# EAGLE design homecomputer-6502 (EAGLE 6.5.0)

## Sheet 1 of 2
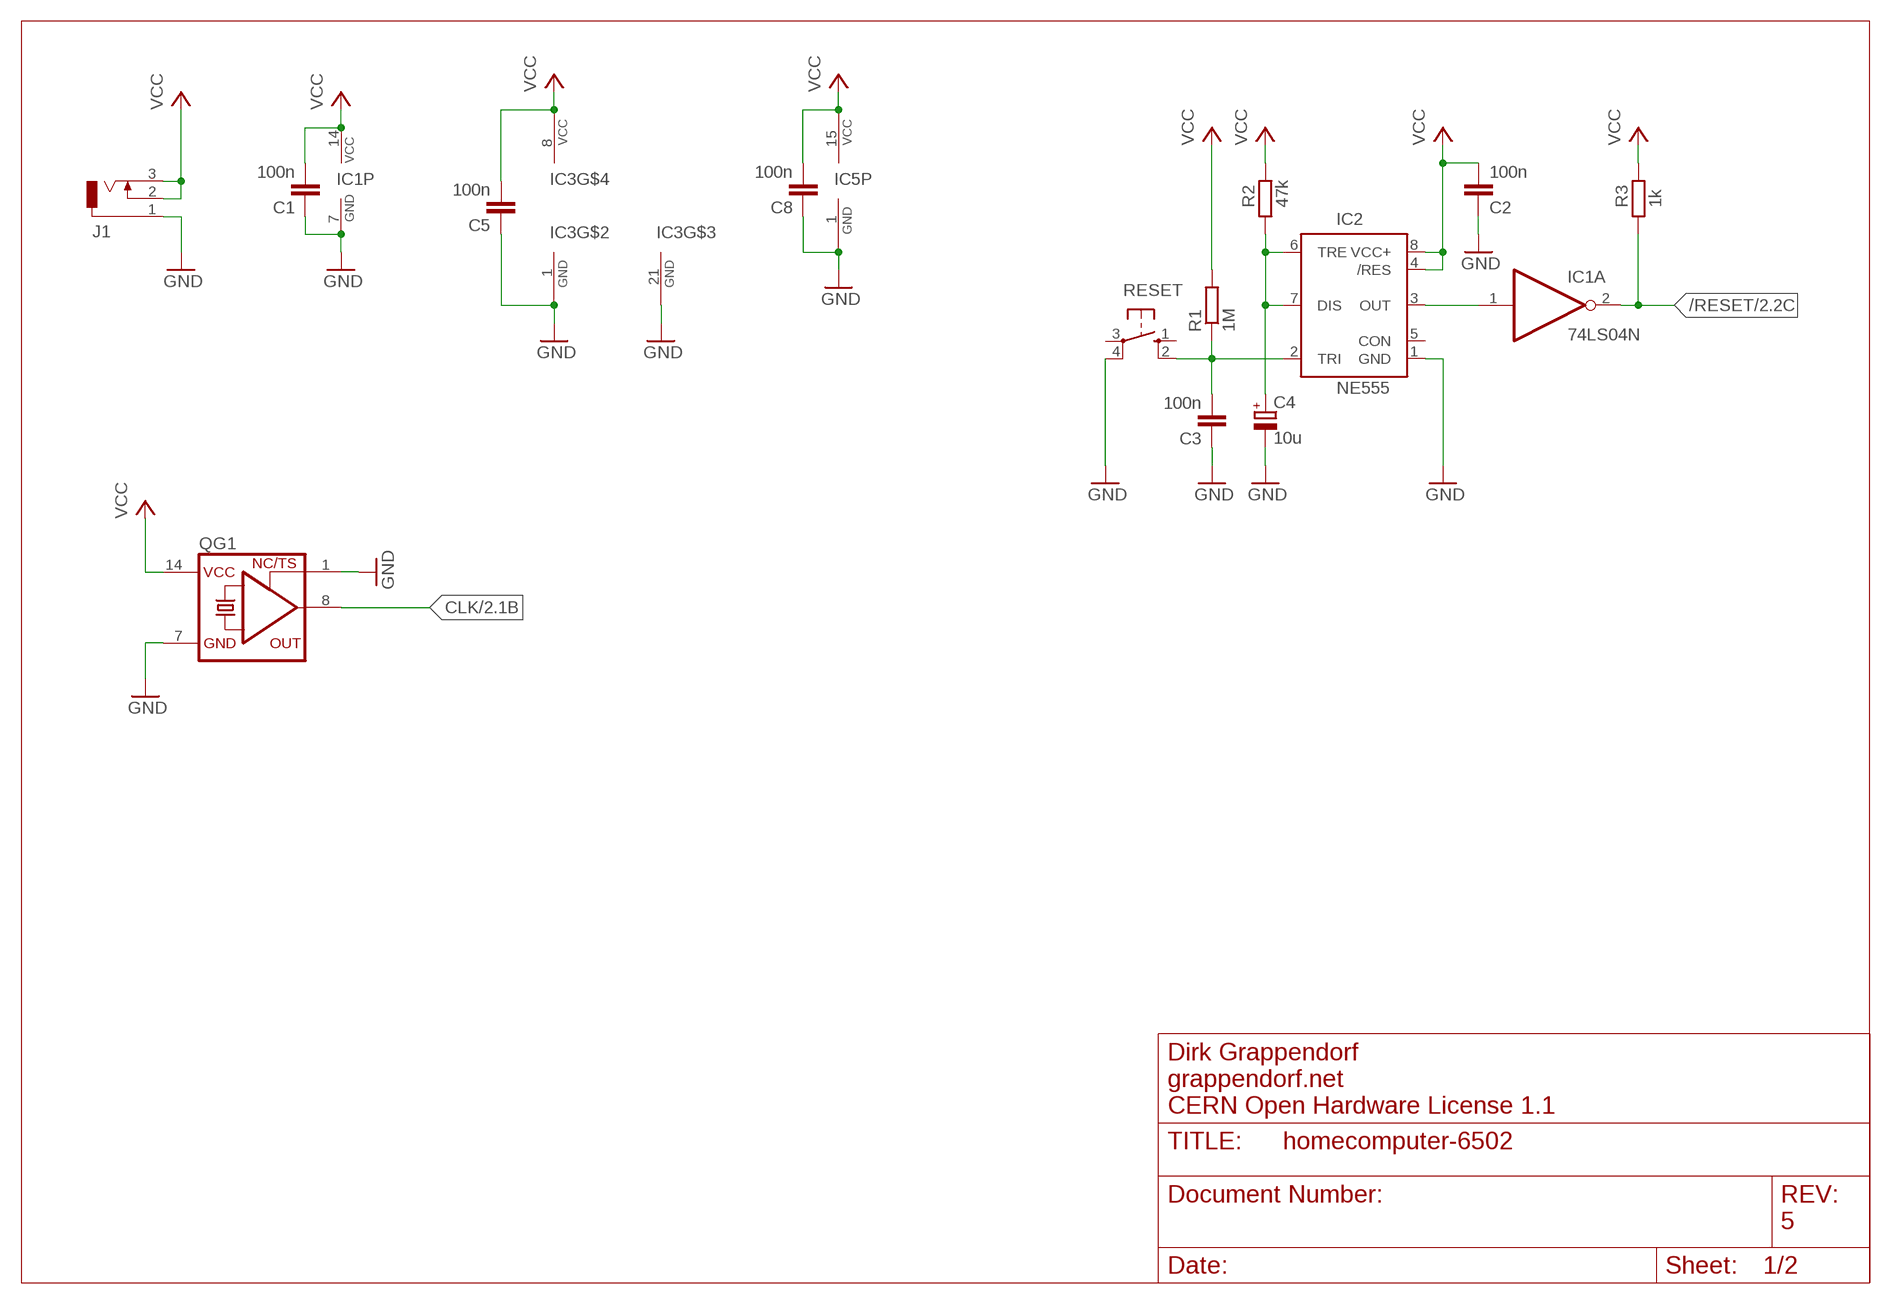
[diagram p0: schematic, sheet 1]

### Parts
C1  100n  C-EU025-024X044  [C025-024X044]
C2  100n  C-EU025-024X044  [C025-024X044]
C3  100n  C-EU025-024X044  [C025-024X044]
C4  10u  CPOL-EUE2,5-6E  [E2,5-6E]
C5  100n  C-EU025-024X044  [C025-024X044]
C8  100n  C-EU025-024X044  [C025-024X044]
IC1  74LS04N  [DIL14]
IC2  NE555  [DIL-08]
IC3  6502  [DIP40]
IC5  6551  [DIP28]
J1  DCJ0303  [DCJ0303]
QG1  XO-14  [DIL14S]
R1  1M  R-EU_0204/5  [0204/5]
R2  47k  R-EU_0204/5  [0204/5]
R3  1k  R-EU_0204/5  [0204/5]
RESET  10-XX  [B3F-10XX]

### Nets
/RESET: IC1.2(A:O) R3.1 ; also sheet 2
CLK: QG1.8(OUT) ; also sheet 2
GND: C1.1 C2.1 C3.1 C4.- C5.1 C8.1 IC1.7(P:GND) IC2.1(GND) IC3.1(GND) IC3.21(GND) IC5.1(GND) J1.1 QG1.1(TS) QG1.7(GND) RESET.4(P1) ; also sheet 2
N$4: C4.+ IC2.6(TRE) IC2.7(DIS) R2.1
N$5: IC1.1(A:I) IC2.3(OUT)
N$6: C3.2 IC2.2(TRI) R1.1 RESET.2(S1)
VCC: C1.2 C2.2 C5.2 C8.2 IC1.14(P:VCC) IC2.4(/RES) IC2.8(VCC+) IC3.8(VCC) IC5.15(VCC) J1.2 J1.3 QG1.14(VCC) R1.2 R2.2 R3.2 ; also sheet 2
Unconnected: IC1.5(C:I) IC1.6(C:O) IC1.8(D:O) IC1.9(D:I) IC1.10(E:O) IC1.11(E:I) IC1.12(F:O) IC1.13(F:I) IC2.5(CON) RESET.1(S) RESET.3(P)

### Notes on the sheet
- Dirk Grappendorf
- grappendorf.net
- CERN Open Hardware License 1.1
- 5

## Sheet 2 of 2
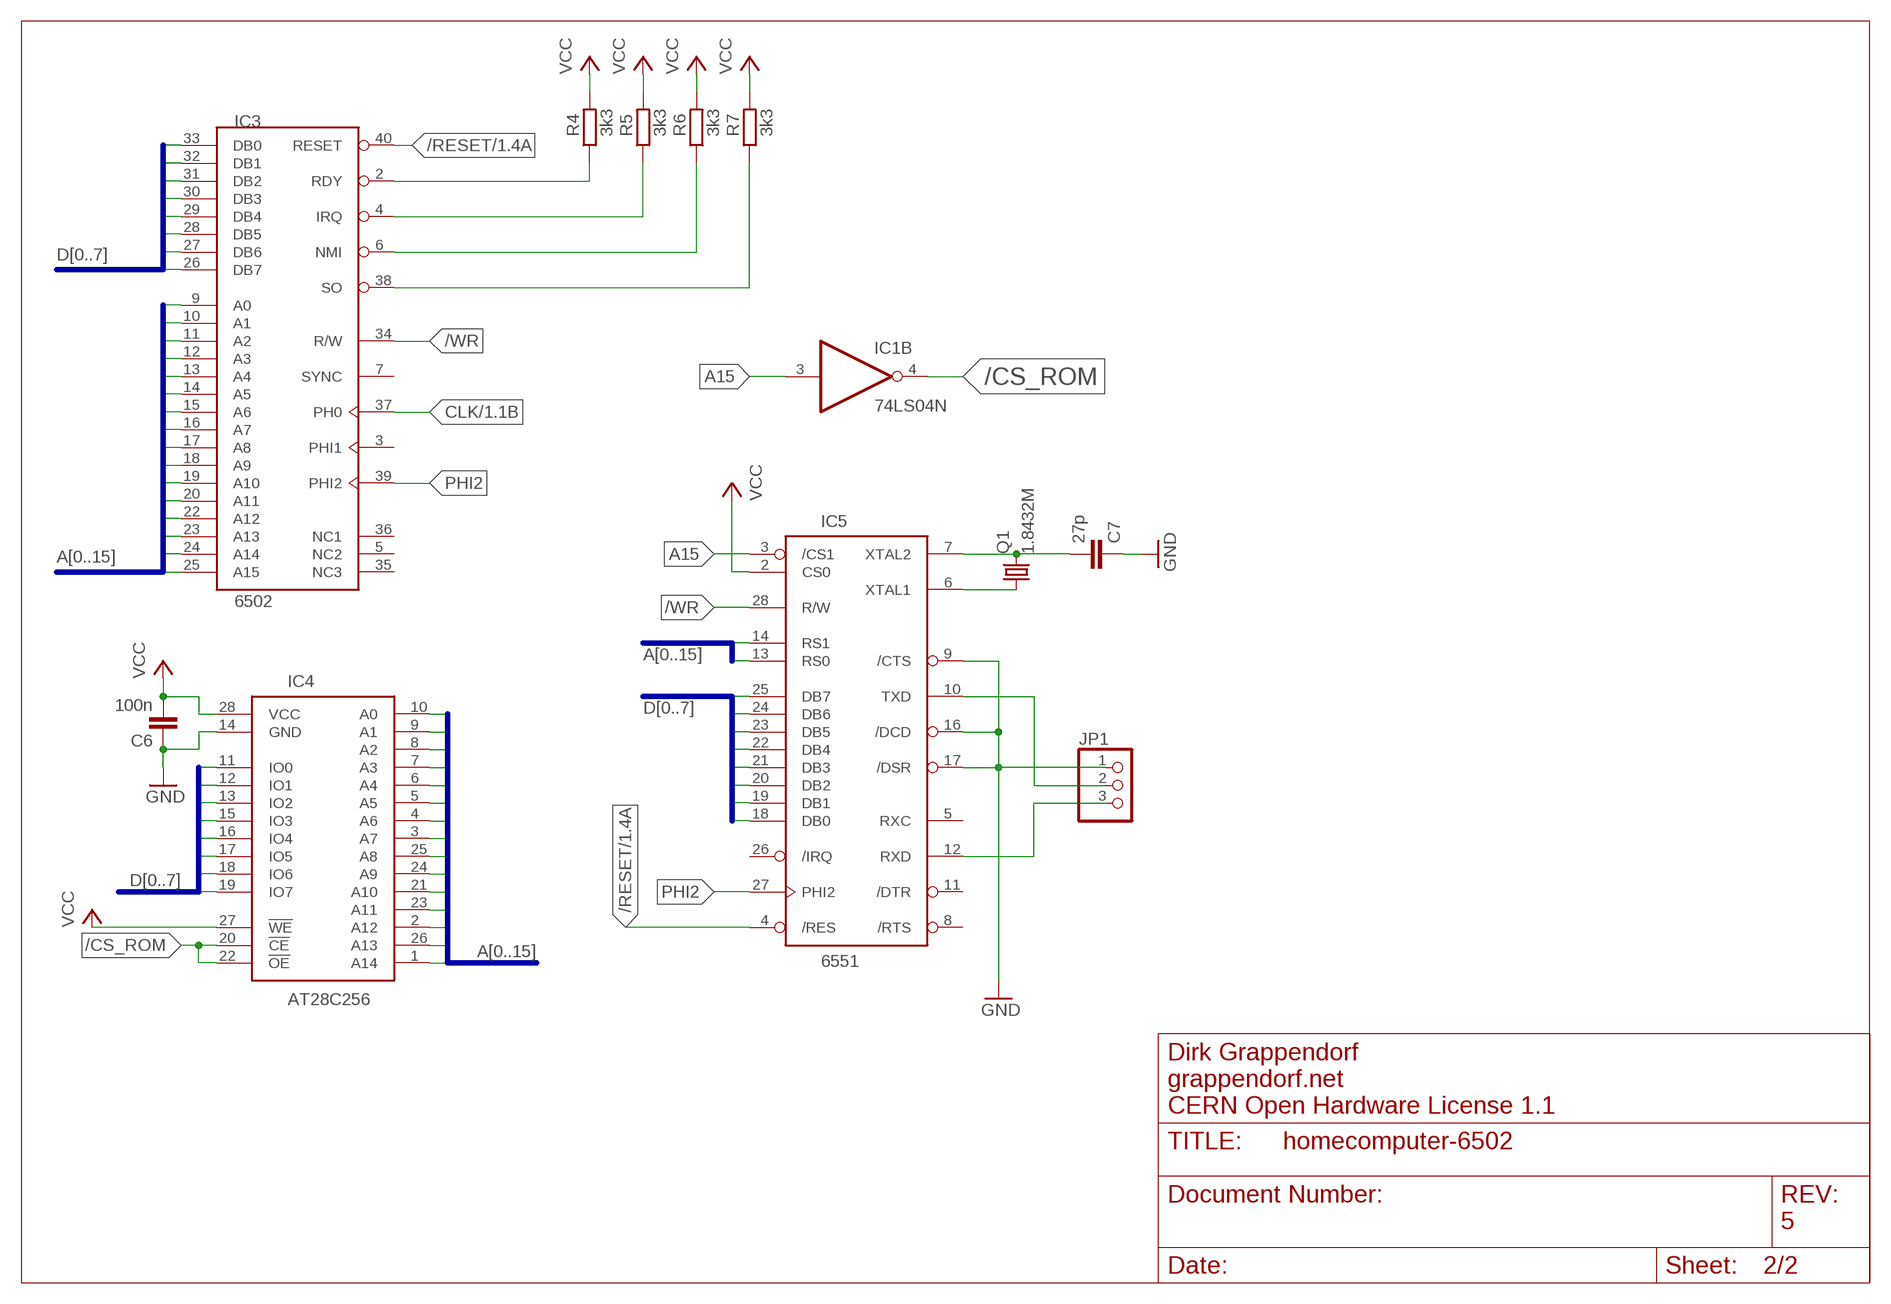
[diagram p1: schematic, sheet 2]

### Parts
C6  100n  C-EU025-024X044  [C025-024X044]
C7  27p  C-EU025-024X044  [C025-024X044]
IC4  AT28C256  [DIL28-6]
JP1  PINHD-1X3_2.54  [1X03]
Q1  1.8432M  CRYSTALHC49U-V  [HC49U-V]
R4  3k3  R-EU_0204/5  [0204/5]
R5  3k3  R-EU_0204/5  [0204/5]
R6  3k3  R-EU_0204/5  [0204/5]
R7  3k3  R-EU_0204/5  [0204/5]

### Nets
/CS_ROM: IC1.4(B:O) IC4.20(!CE) IC4.22(!OE)
/RESET: IC3.40(RESET) IC5.4(/RES) ; also sheet 1
/WR: IC3.34(R/W) IC5.28(R/W)
A0: IC3.9(A0) IC4.10(A0) IC5.13(RS0)
A1: IC3.10(A1) IC4.9(A1) IC5.14(RS1)
A2: IC3.11(A2) IC4.8(A2)
A3: IC3.12(A3) IC4.7(A3)
A4: IC3.13(A4) IC4.6(A4)
A5: IC3.14(A5) IC4.5(A5)
A6: IC3.15(A6) IC4.4(A6)
A7: IC3.16(A7) IC4.3(A7)
A8: IC3.17(A8) IC4.25(A8)
A9: IC3.18(A9) IC4.24(A9)
A10: IC3.19(A10) IC4.21(A10)
A11: IC3.20(A11) IC4.23(A11)
A12: IC3.22(A12) IC4.2(A12)
A13: IC3.23(A13) IC4.26(A13)
A14: IC3.24(A14) IC4.1(A14)
A15: IC1.3(B:I) IC3.25(A15) IC5.3(/CS1)
CLK: IC3.37(PH0) ; also sheet 1
D0: IC3.33(DB0) IC4.11(IO0) IC5.18(DB0)
D1: IC3.32(DB1) IC4.12(IO1) IC5.19(DB1)
D2: IC3.31(DB2) IC4.13(IO2) IC5.20(DB2)
D3: IC3.30(DB3) IC4.15(IO3) IC5.21(DB3)
D4: IC3.29(DB4) IC4.16(IO4) IC5.22(DB4)
D5: IC3.28(DB5) IC4.17(IO5) IC5.23(DB5)
D6: IC3.27(DB6) IC4.18(IO6) IC5.24(DB6)
D7: IC3.26(DB7) IC4.19(IO7) IC5.25(DB7)
GND: C6.1 C7.1 IC4.14(GND) IC5.9(/CTS) IC5.16(/DCD) IC5.17(/DSR) JP1.1 ; also sheet 1
N$1: C7.2 IC5.7(XTAL2) Q1.2
N$2: IC5.6(XTAL1) Q1.1
N$3: IC3.2(RDY) R4.1
N$8: IC5.10(TXD) JP1.2
N$9: IC3.4(IRQ) R5.1
N$10: IC3.6(NMI) R6.1
N$11: IC3.38(SO) R7.1
N$12: IC5.12(RXD) JP1.3
PHI2: IC3.39(PHI2) IC5.27(PHI2)
VCC: C6.2 IC4.27(!WE) IC4.28(VCC) IC5.2(CS0) R4.2 R5.2 R6.2 R7.2 ; also sheet 1
Unconnected: IC3.3(PHI1) IC3.5(NC2) IC3.7(SYNC) IC3.35(NC3) IC3.36(NC1) IC5.5(RXC) IC5.8(/RTS) IC5.11(/DTR) IC5.26(/IRQ)

### Buses
A[0..15]
D[0..7]

### Notes on the sheet
- Dirk Grappendorf
- grappendorf.net
- CERN Open Hardware License 1.1
- 5

## Library data of the parts
C1-C3 C5-C8 = rcl:C-EU: CAPACITOR, European symbol
C4 = rcl:CPOL-EU: POLARIZED CAPACITOR, European symbol
IC1 = 74xx-eu:74*04: Hex INVERTER
IC2 = st-microelectronics:NE555: General purpose bipolar Timer; MF: Arrow Electronics; MPN: NE555N; OC_FARNELL: 1467742; OC_NEWARK: 89K1486
IC3 = 6502:6502: 6502 processor
IC4 = atmel-28c:AT28C256: EEPROM 32Kx8 256k bit The AT28C256 is a high-performance Electrically Erasable and Programmable Read Only Memory. Its 256K of memory is organized as 32,768 words by 8 bits.
IC5 = 6502:6551: ACIA. Capable of RS-232
J1 = con-jack:DCJ0303: DC POWER JACK Source: DCJ0303.pdf; OC_FARNELL: unknown; OC_NEWARK: unknown
JP1 = pinhead-1:PINHD-1X3: PIN HEADER
Q1 = crystal:CRYSTAL: CRYSTAL; OC_FARNELL: 1666969; OC_NEWARK: unknown
QG1 = crystal2:XO-: CRYSTAL
R1-R7 = rcl:R-EU_: RESISTOR, European symbol
RESET = switch-omron:10-XX: OMRON SWITCH; MPN: B3F-1000; OC_FARNELL: 176432; OC_NEWARK: 36M3542

## Board
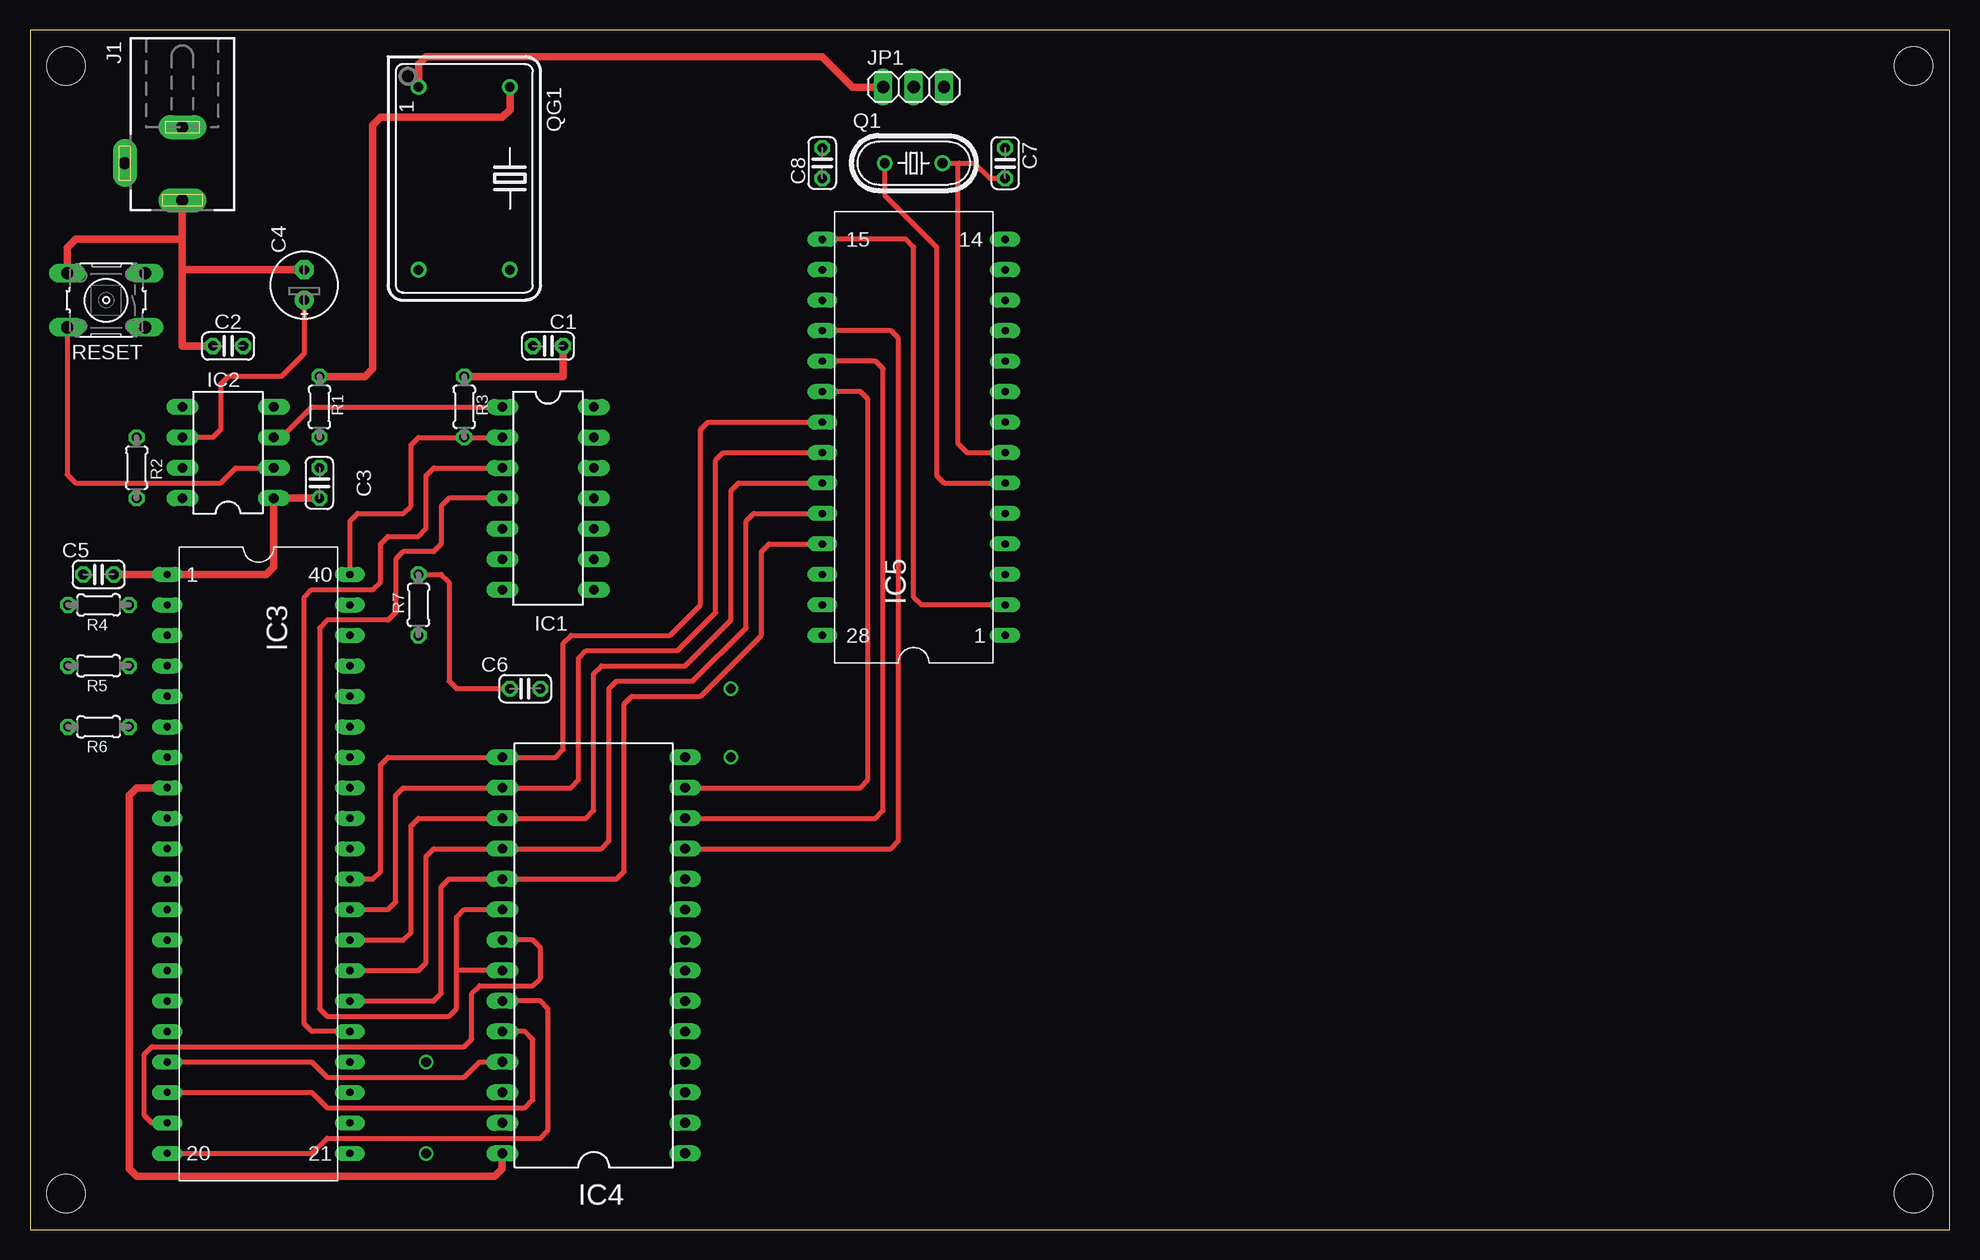
[diagram p2: board, top side]
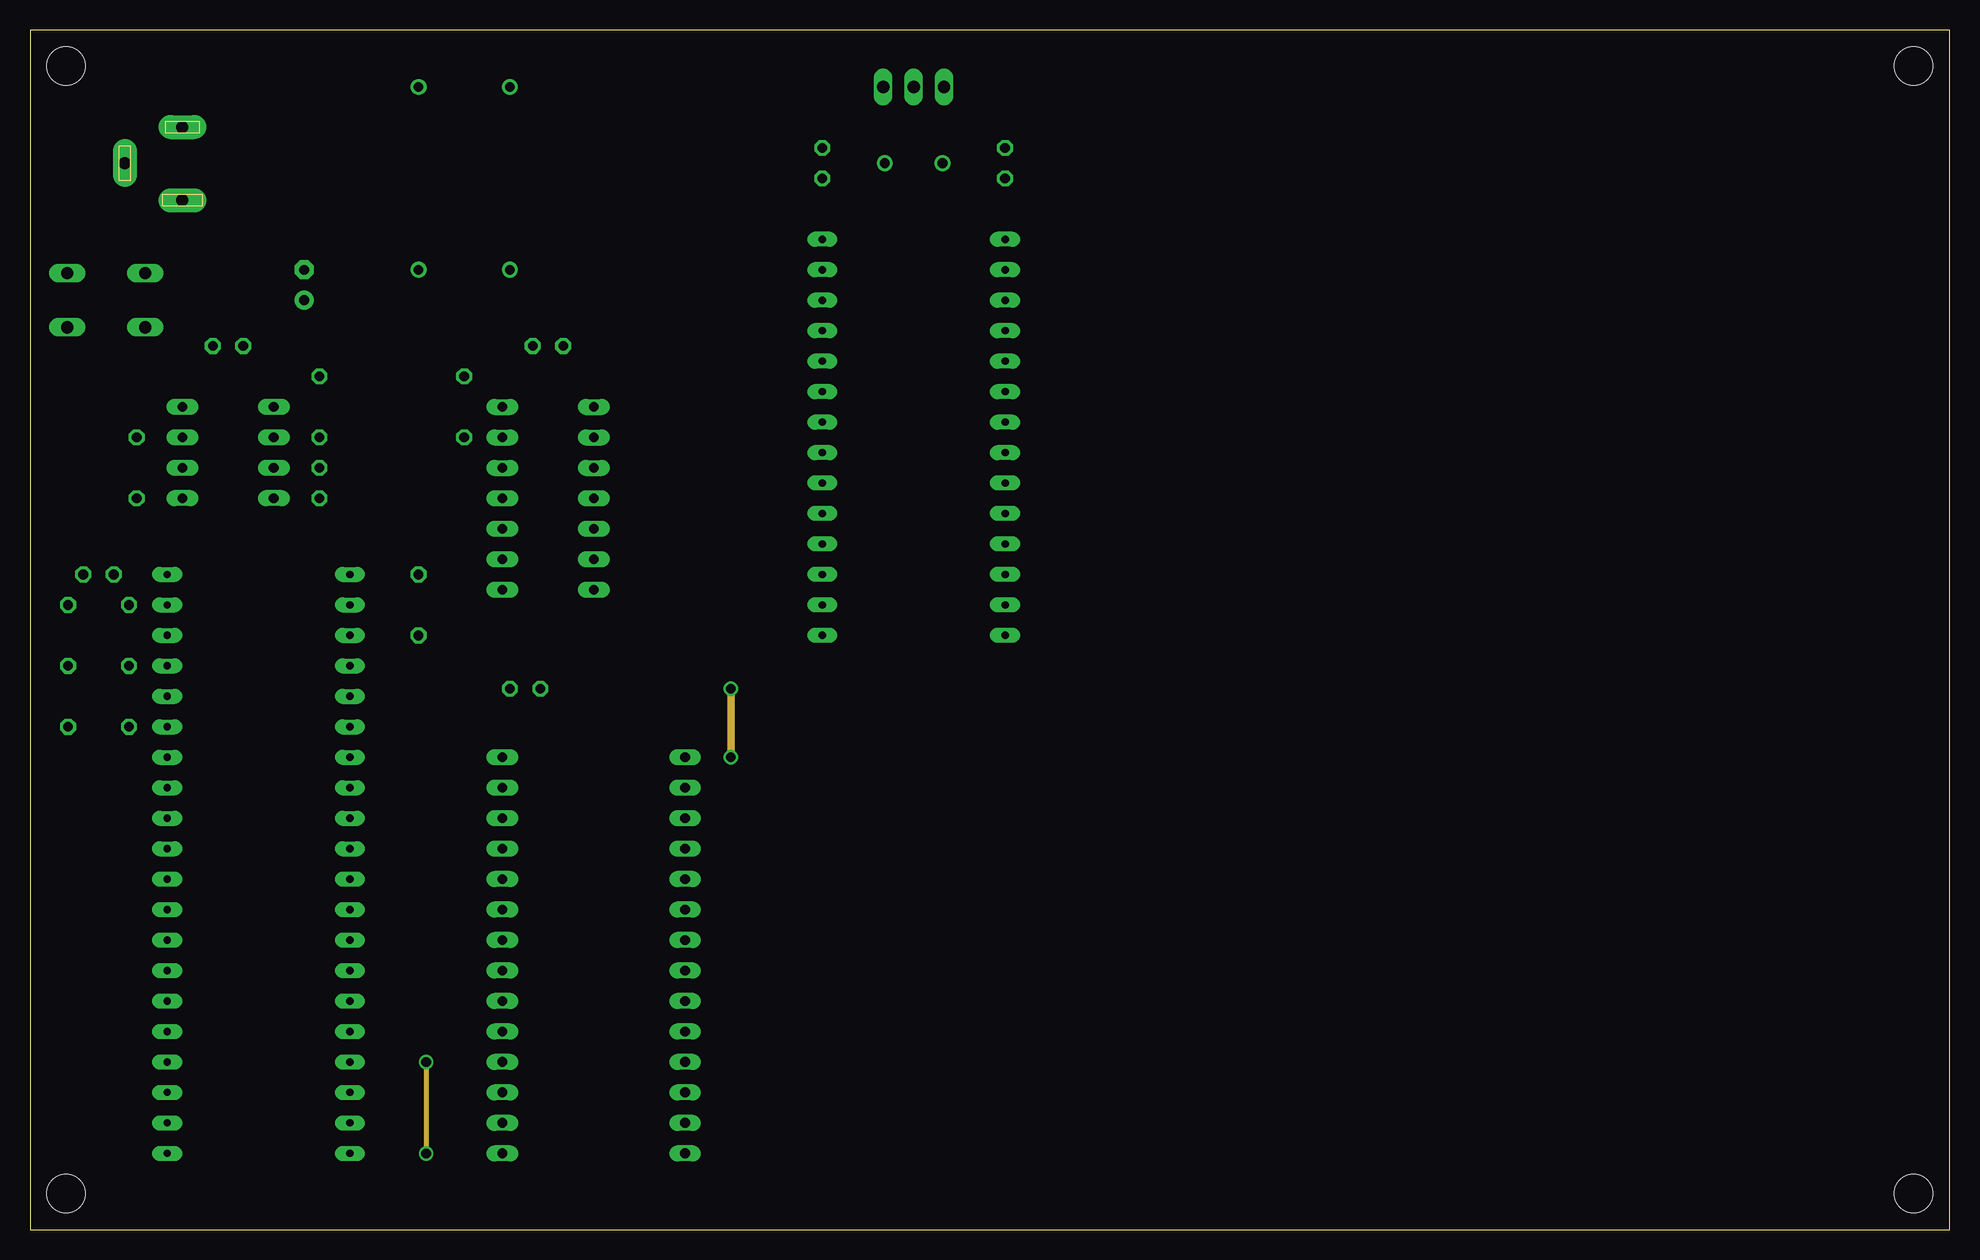
[diagram p3: board, inner layer Route2]
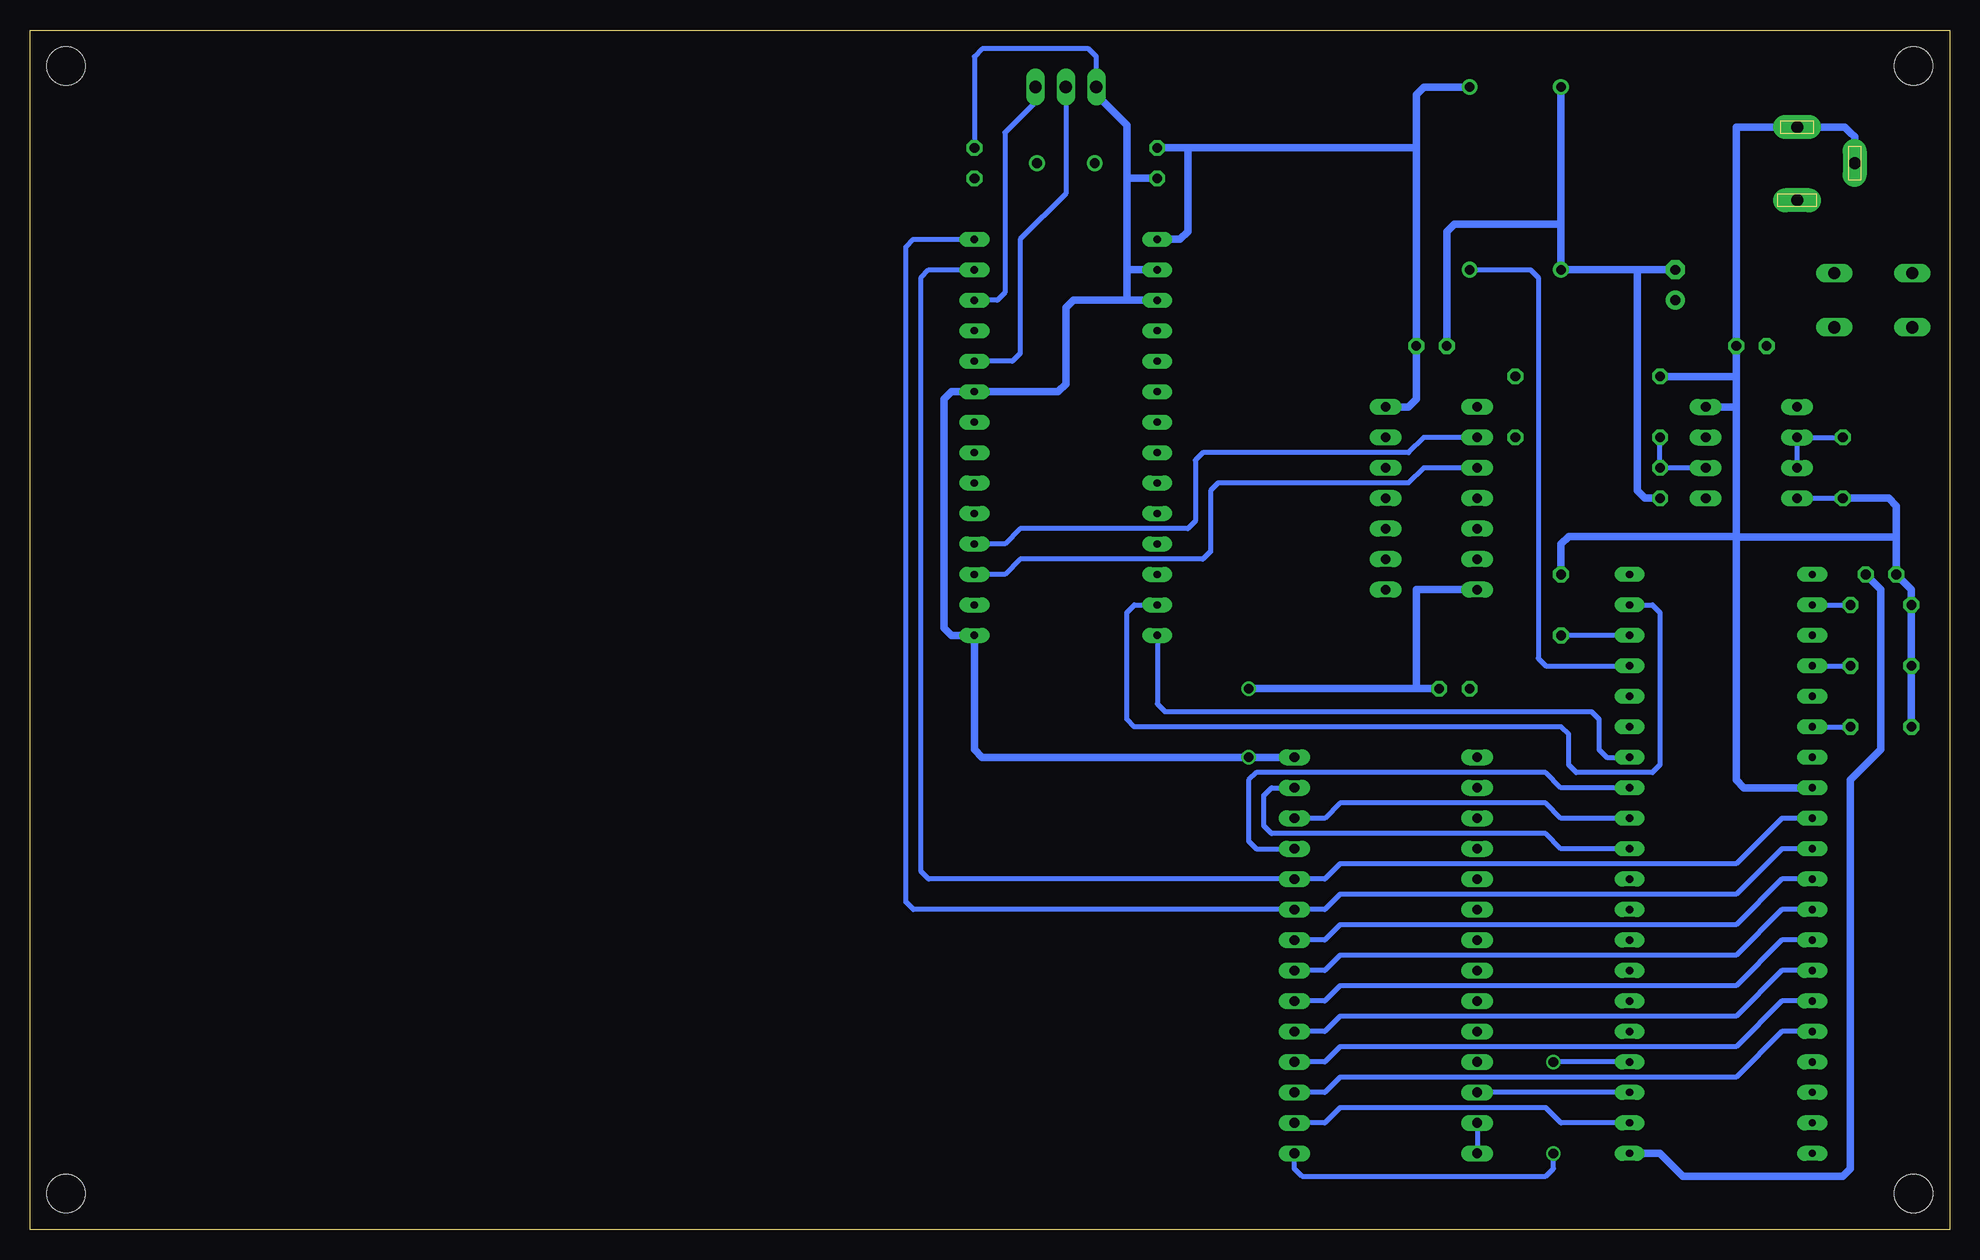
[diagram p4: board, bottom side, seen from below]

Size 160 x 100 mm. Coordinates in mm from the lower left corner, seen from the top.
Outline: 0,0 160,0 160,100 0,100 0,0
Copper layers (1*2*16): Top 0.035mm / dielectric 0.75mm / Route2 0.035mm / dielectric 0.75mm / Bottom 0.035mm
Design rules "default *": minimum track width 10mil, minimum drill 24mil, track to track 8mil, track to pad 8mil, pad to pad 8mil, via to via 8mil, smd to smd 8mil, copper to edge 40mil, drill to drill 8mil, minimum pad ring 10mil, minimum via ring 8mil, stop-mask expansion 4mil, vias tented up to drill 0mil, thermal gap 10mil
Holes 3.2 mm at 3,97 157,97 3,3 157,3

### Footprints (pad centres in the part's own frame; a part is rotated, then mirrored left to right if it is on the bottom)
C025-024X044 = drill 0.813 octagon: 1 -1.27,0; 2 1.27,0
E2,5-6E = drill 0.813 pad 1.575: + -1.27,0 | drill 0.813 pad 1.575 octagon: - 1.27,0
DIL14 = drill 0.813 long: 1 -7.62,-3.81; 2 -5.08,-3.81; 3 -2.54,-3.81; 4 0,-3.81; 5 2.54,-3.81; 6 5.08,-3.81; 7 7.62,-3.81; 8 7.62,3.81; 9 5.08,3.81; 10 2.54,3.81; 11 0,3.81; 12 -2.54,3.81; 13 -5.08,3.81; 14 -7.62,3.81
DIL-08 = drill 0.813 long: 1 -3.81,-3.81; 2 -1.27,-3.81; 3 1.27,-3.81; 4 3.81,-3.81; 5 3.81,3.81; 6 1.27,3.81; 7 -1.27,3.81; 8 -3.81,3.81
DIP40 = drill 0.61 pad 1.27 long: 1 -24.13,-7.62; 2 -21.59,-7.62; 3 -19.05,-7.62; 4 -16.51,-7.62; 5 -13.97,-7.62; 6 -11.43,-7.62; 7 -8.89,-7.62; 8 -6.35,-7.62; 9 -3.81,-7.62; 10 -1.27,-7.62; 11 1.27,-7.62; 12 3.81,-7.62; 13 6.35,-7.62; 14 8.89,-7.62; 15 11.43,-7.62; 16 13.97,-7.62; 17 16.51,-7.62; 18 19.05,-7.62; 19 21.59,-7.62; 20 24.13,-7.62; 21 24.13,7.62; 22 21.59,7.62; 23 19.05,7.62; 24 16.51,7.62; 25 13.97,7.62; 26 11.43,7.62; 27 8.89,7.62; 28 6.35,7.62; 29 3.81,7.62; 30 1.27,7.62; 31 -1.27,7.62; 32 -3.81,7.62; 33 -6.35,7.62; 34 -8.89,7.62; 35 -11.43,7.62; 36 -13.97,7.62; 37 -16.51,7.62; 38 -19.05,7.62; 39 -21.59,7.62; 40 -24.13,7.62
DIL28-6 = drill 0.813 long: 1 -16.51,-7.62; 2 -13.97,-7.62; 3 -11.43,-7.62; 4 -8.89,-7.62; 5 -6.35,-7.62; 6 -3.81,-7.62; 7 -1.27,-7.62; 8 1.27,-7.62; 9 3.81,-7.62; 10 6.35,-7.62; 11 8.89,-7.62; 12 11.43,-7.62; 13 13.97,-7.62; 14 16.51,-7.62; 15 16.51,7.62; 16 13.97,7.62; 17 11.43,7.62; 18 8.89,7.62; 19 6.35,7.62; 20 3.81,7.62; 21 1.27,7.62; 22 -1.27,7.62; 23 -3.81,7.62; 24 -6.35,7.62; 25 -8.89,7.62; 26 -11.43,7.62; 27 -13.97,7.62; 28 -16.51,7.62
DIP28 = drill 0.61 pad 1.27 long: 1 -16.51,-7.62; 2 -13.97,-7.62; 3 -11.43,-7.62; 4 -8.89,-7.62; 5 -6.35,-7.62; 6 -3.81,-7.62; 7 -1.27,-7.62; 8 1.27,-7.62; 9 3.81,-7.62; 10 6.35,-7.62; 11 8.89,-7.62; 12 11.43,-7.62; 13 13.97,-7.62; 14 16.51,-7.62; 15 16.51,7.62; 16 13.97,7.62; 17 11.43,7.62; 18 8.89,7.62; 19 6.35,7.62; 20 3.81,7.62; 21 1.27,7.62; 22 -1.27,7.62; 23 -3.81,7.62; 24 -6.35,7.62; 25 -8.89,7.62; 26 -11.43,7.62; 27 -13.97,7.62; 28 -16.51,7.62
DCJ0303 = drill 1 pad 2 long: 1 0,3.1; 2 4.8,0; 3 0,-3
1X03 = drill 1.016 long: 1 -2.54,0; 2 0,0; 3 2.54,0
HC49U-V = drill 0.813: 1 -2.413,0; 2 2.413,0
DIL14S = drill 0.813: 1 -7.62,-3.81; 7 7.62,-3.81; 8 7.62,3.81; 14 -7.62,3.81
0204/5 = drill 0.813 octagon: 1 -2.54,0; 2 2.54,0
B3F-10XX = drill 1.016 long: 1 -3.251,2.261; 2 3.251,2.261; 3 -3.251,-2.261; 4 3.251,-2.261

### Placement (x,y rotation side)
C1  43.18,73.66 0 top
C2  16.51,73.66 0 top
C3  24.13,62.23 90 top
C4  22.86,78.74 90 top
C5  5.71,54.61 180 top
C6  41.27,45.09 180 top
C7  81.28,88.9 270 top
C8  66.04,88.9 90 top
IC1  43.18,60.96 270 top
IC2  16.51,64.77 90 top
IC3  19.05,30.48 270 top
IC4  46.99,22.86 90 top
IC5  73.66,66.04 90 top
J1  12.7,88.9 180 top
JP1  73.66,95.25 0 top
Q1  73.66,88.9 0 top
QG1  36.2,87.63 270 top
R1  24.13,68.58 90 top
R2  8.89,63.5 270 top
R3  36.2,68.58 90 top
R4  5.71,52.07 180 top
R5  5.71,46.99 180 top
R6  5.71,41.91 180 top
R7  32.38,52.07 90 top
RESET  6.35,77.47 180 top

### Tracks (layer width: path | path; a pad name or v marks a point on that pad's centre or on a via)
/CS_ROM
  Top 0.406: IC1.4 34.92,60.96 34.29,60.33 34.29,57.15 33.66,56.52 31.11,56.52 30.48,55.88 30.48,51.44 29.84,50.8 24.77,50.8 24.13,50.16 24.13,18.41 24.77,17.78 34.92,17.78 35.56,18.41 35.56,21.59 | 35.56,21.59 35.56,26.04 36.2,26.67 IC4.20 | IC4.22 35.56,21.59
/RESET
  Top 0.406: IC3.40 26.67,59.05 27.3,59.69 31.11,59.69 31.75,60.33 31.75,65.41 32.38,66.04 R3.1 IC1.2
  Bottom 0.406: IC1.2 43.81,66.04 45.09,64.77 62.23,64.77 62.87,64.14 62.87,59.05 63.5,58.42 77.47,58.42 78.74,57.15 IC5.4
/WR
  Bottom 0.406: IC5.28 66.04,43.81 65.41,43.18 29.84,43.18 29.21,42.55 29.21,40.01 28.57,39.37 IC3.34
A0
  Bottom 0.406: IC3.9 13.97,34.29 17.78,30.48 50.8,30.48 52.07,29.21 IC4.10 85.09,29.21 85.72,29.84 85.72,79.38 85.09,80.01 IC5.13
A1
  Bottom 0.406: IC3.10 13.97,31.75 17.78,27.94 50.8,27.94 52.07,26.67 IC4.9 86.36,26.67 87,27.3 87,81.92 86.36,82.55 IC5.14
A2
  Bottom 0.406: IC3.11 13.97,29.21 17.78,25.4 50.8,25.4 52.07,24.13 IC4.8
A3
  Bottom 0.406: IC3.12 13.97,26.67 17.78,22.86 50.8,22.86 52.07,21.59 IC4.7
A4
  Bottom 0.406: IC3.13 13.97,24.13 17.78,20.32 50.8,20.32 52.07,19.05 IC4.6
A5
  Bottom 0.406: IC3.14 13.97,21.59 17.78,17.78 50.8,17.78 52.07,16.51 IC4.5
A6
  Bottom 0.406: IC3.15 13.97,19.05 17.78,15.24 50.8,15.24 52.07,13.97 IC4.4
A7
  Bottom 0.406: IC3.16 13.97,16.51 17.78,12.7 50.8,12.7 52.07,11.43 IC4.3
A8
  Top 0.406: IC3.17 23.5,13.97 24.77,12.7 36.2,12.7 37.47,13.97 IC4.25
A9
  Top 0.406: IC3.18 23.5,11.43 24.77,10.16 41.27,10.16 41.91,10.79 41.91,15.88 41.27,16.51 IC4.24
A10
  Top 0.406: IC3.19 10.16,8.89 9.53,9.53 9.53,14.61 10.16,15.24 36.2,15.24 36.83,15.88 36.83,19.68 37.47,20.32 41.91,20.32 42.55,20.95 42.55,23.5 41.91,24.13 IC4.21
A11
  Top 0.406: IC3.20 23.5,6.35 24.77,7.62 42.55,7.62 43.18,8.26 43.18,18.41 42.55,19.05 IC4.23
A12
  Bottom 0.406: IC3.22 32.38,8.89 33.66,10.16 50.8,10.16 52.07,8.89 IC4.2
A13
  Bottom 0.406: IC3.23 IC4.26
A14  (via drill 0.8)
  Route2 0.406: v33.02,13.97 v33.02,6.35
  Bottom 0.406: IC3.24 v33.02,13.97 | IC4.1 54.61,5.08 53.98,4.45 33.66,4.45 33.02,5.08 v33.02,6.35
A15
  Top 0.406: IC3.25 23.5,16.51 22.86,17.14 22.86,52.7 23.5,53.34 28.57,53.34 29.21,53.98 29.21,57.15 29.84,57.78 32.38,57.78 33.02,58.42 33.02,62.87 33.66,63.5 IC1.3
  Bottom 0.406: IC1.3 43.81,63.5 45.09,62.23 60.96,62.23 61.59,61.59 61.59,56.52 62.23,55.88 77.47,55.88 78.74,54.61 IC5.3
CLK
  Bottom 0.406: QG1.8 34.92,80.01 34.29,79.38 34.29,47.62 33.66,46.99 IC3.37
D0
  Top 0.406: IC4.11 71.75,31.75 72.39,32.38 72.39,74.3 71.75,74.93 IC5.18
  Bottom 0.406: IC3.33 32.38,36.83 33.66,38.1 57.78,38.1 58.42,37.47 58.42,32.38 57.78,31.75 IC4.11
D1
  Top 0.406: IC4.12 70.48,34.29 71.12,34.92 71.12,71.75 70.48,72.39 IC5.19
  Bottom 0.406: IC3.32 32.38,34.29 33.66,35.56 50.8,35.56 52.07,34.29 IC4.12
D2
  Top 0.406: IC4.13 69.22,36.83 69.85,37.47 69.85,69.22 69.22,69.85 IC5.20
  Bottom 0.406: IC3.31 32.38,31.75 33.66,33.02 56.52,33.02 57.15,33.66 57.15,36.2 56.52,36.83 IC4.13
D3
  Top 0.406: IC3.30 28.57,29.21 29.21,29.84 29.21,38.73 29.84,39.37 IC4.15 43.81,39.37 44.45,40.01 44.45,48.9 45.09,49.53 53.34,49.53 55.88,52.07 55.88,66.67 56.52,67.31 IC5.21
D4
  Top 0.406: IC3.29 29.84,26.67 30.48,27.3 30.48,36.2 31.11,36.83 IC4.16 45.09,36.83 45.72,37.47 45.72,47.62 46.35,48.26 53.98,48.26 57.15,51.44 57.15,64.14 57.78,64.77 IC5.22
D5
  Top 0.406: IC3.28 31.11,24.13 31.75,24.77 31.75,33.66 32.38,34.29 IC4.17 46.35,34.29 46.99,34.92 46.99,46.35 47.62,46.99 54.61,46.99 58.42,50.8 58.42,61.59 59.05,62.23 IC5.23
D6
  Top 0.406: IC3.27 32.38,21.59 33.02,22.23 33.02,31.11 33.66,31.75 IC4.18 47.62,31.75 48.26,32.38 48.26,45.09 48.9,45.72 55.24,45.72 59.69,50.16 59.69,59.05 60.33,59.69 IC5.24
D7
  Top 0.406: IC3.26 33.66,19.05 34.29,19.68 34.29,28.57 34.92,29.21 IC4.19 48.9,29.21 49.53,29.84 49.53,43.81 50.16,44.45 55.88,44.45 60.96,49.53 60.96,56.52 61.59,57.15 IC5.25
GND  (via drill 0.8)
  Top 0.61: C5.1 IC3.1 19.68,54.61 20.32,55.24 IC2.1 C3.1 | J1.1 12.7,82.55 | 12.7,82.55 12.7,80.01 | 12.7,80.01 12.7,73.66 C2.1 | RESET.4 3.1,81.84 3.81,82.55 12.7,82.55 | C4.- 12.7,80.01 | QG1.1 32.38,97.16 33.02,97.79 66.04,97.79 68.58,95.25 JP1.1
  Route2 0.61: v58.42,45.09 v58.42,39.37
  Bottom 0.406: JP1.1 71.12,97.79 71.75,98.42 80.64,98.42 81.28,97.79 C7.1
  Bottom 0.61: C4.- 26.04,80.01 | QG1.1 32.38,83.82 | 32.38,83.82 QG1.7 31.75,80.01 26.04,80.01 | C3.1 25.4,60.96 26.04,61.59 26.04,72.39 26.04,80.01 | C1.1 41.91,83.19 41.27,83.82 32.38,83.82 | 44.45,45.09 C6.1 | 44.45,45.09 44.45,53.34 IC1.7 | JP1.1 71.12,94.61 68.58,92.08 68.58,87.63 | C8.1 68.58,87.63 | IC3.21 24.13,6.35 22.23,4.45 8.89,4.45 8.26,5.08 8.26,37.47 5.71,40.01 5.71,53.34 C5.1 | 68.58,77.47 73.03,77.47 73.66,76.83 73.66,70.48 74.3,69.85 IC5.9 83.19,69.85 83.82,69.22 83.82,50.16 83.19,49.53 IC5.1 81.28,40.01 80.64,39.37 v58.42,39.37 IC4.14 | 68.58,77.47 IC5.17 | 68.58,87.63 68.58,80.01 | 68.58,80.01 68.58,77.47 | IC5.16 68.58,80.01 | 44.45,45.09 v58.42,45.09
N$1
  Top 0.406: IC5.7 78.11,64.77 77.34,65.53 77.34,88.77 77.47,88.9 | Q1.2 77.47,88.9 | 77.47,88.9 78.74,88.9 80.01,87.63 C7.2
N$2
  Top 0.406: Q1.1 71.25,86.23 75.56,81.92 75.56,62.87 76.2,62.23 IC5.6
N$3
  Bottom 0.406: IC3.2 R4.1
N$4
  Top 0.406: C4.+ 22.86,73.03 20.95,71.12 16.51,71.12 15.88,70.48 15.88,66.67 15.24,66.04 IC2.6
  Bottom 0.406: IC2.7 IC2.6 R2.1
N$5
  Top 0.406: IC2.3 20.95,66.04 23.5,68.58 IC1.1
N$6
  Top 0.406: RESET.2 3.1,62.94 3.81,62.23 15.88,62.23 17.14,63.5 IC2.2
  Bottom 0.406: IC2.2 C3.2 R1.1
N$8
  Bottom 0.406: JP1.2 73.66,86.36 77.47,82.55 77.47,73.03 78.11,72.39 IC5.10
N$9
  Bottom 0.406: IC3.4 R5.1
N$10
  Bottom 0.406: IC3.6 R6.1
N$11
  Bottom 0.406: IC3.38 R7.1
N$12
  Bottom 0.406: JP1.3 76.2,93.98 78.74,91.44 78.74,78.11 79.38,77.47 IC5.12
PHI2
  Bottom 0.406: IC3.39 24.77,52.07 24.13,51.44 24.13,38.73 24.77,38.1 31.11,38.1 31.75,38.73 31.75,41.27 32.38,41.91 67.94,41.91 68.58,42.55 68.58,51.44 67.94,52.07 IC5.27
VCC
  Top 0.406: R7.2 34.29,54.61 34.92,53.98 34.92,45.72 35.56,45.09 C6.2 | IC5.2 74.3,52.07 73.66,52.7 73.66,81.92 73.03,82.55 IC5.15
  Top 0.61: R1.2 27.94,71.12 28.57,71.75 28.57,92.08 29.21,92.71 39.37,92.71 40.01,93.34 QG1.14 | C1.2 44.45,71.12 R3.2 | IC4.28 39.37,5.08 38.73,4.45 8.89,4.45 8.26,5.08 8.26,36.2 8.89,36.83 IC3.8
  Bottom 0.406: IC4.27 IC4.28 | IC2.8 R2.2
  Bottom 0.61: J1.2 7.9,91.08 8.26,91.44 8.71,91.9 J1.3 17.78,91.9 C2.2 17.78,71.12 | R6.2 R5.2 R4.2 3.17,53.34 C5.2 4.45,57.71 | 17.78,71.12 17.78,68.58 | 17.78,68.58 17.78,57.78 | 17.78,57.78 17.78,37.47 17.14,36.83 IC3.8 | 4.45,57.71 4.45,60.33 5.08,60.96 R2.2 | 4.45,57.71 17.71,57.71 17.78,57.78 | 17.78,57.78 31.75,57.78 32.38,57.15 R7.2 | IC2.4 17.78,68.58 | R1.2 17.78,71.12 | IC1.14 45.09,68.58 44.45,69.22 C1.2 44.45,90.17 | 44.45,90.17 44.45,94.61 43.81,95.25 QG1.14 | C8.2 63.5,90.17 | 63.5,90.17 44.45,90.17 | IC5.15 64.14,82.55 63.5,83.19 63.5,90.17